# EasyEDA Pro project 电池盒升压.eprj

# Schematic Schematic1
Board Name: Board1; Create Date: 2025-10-24; Page Name: P1; Project Name: 电池盒升压; Schematic Name: Schematic1; Update Date: 2025-11-20; Company: 嘉立创EDA; Page Size: A4; Version: V1.0
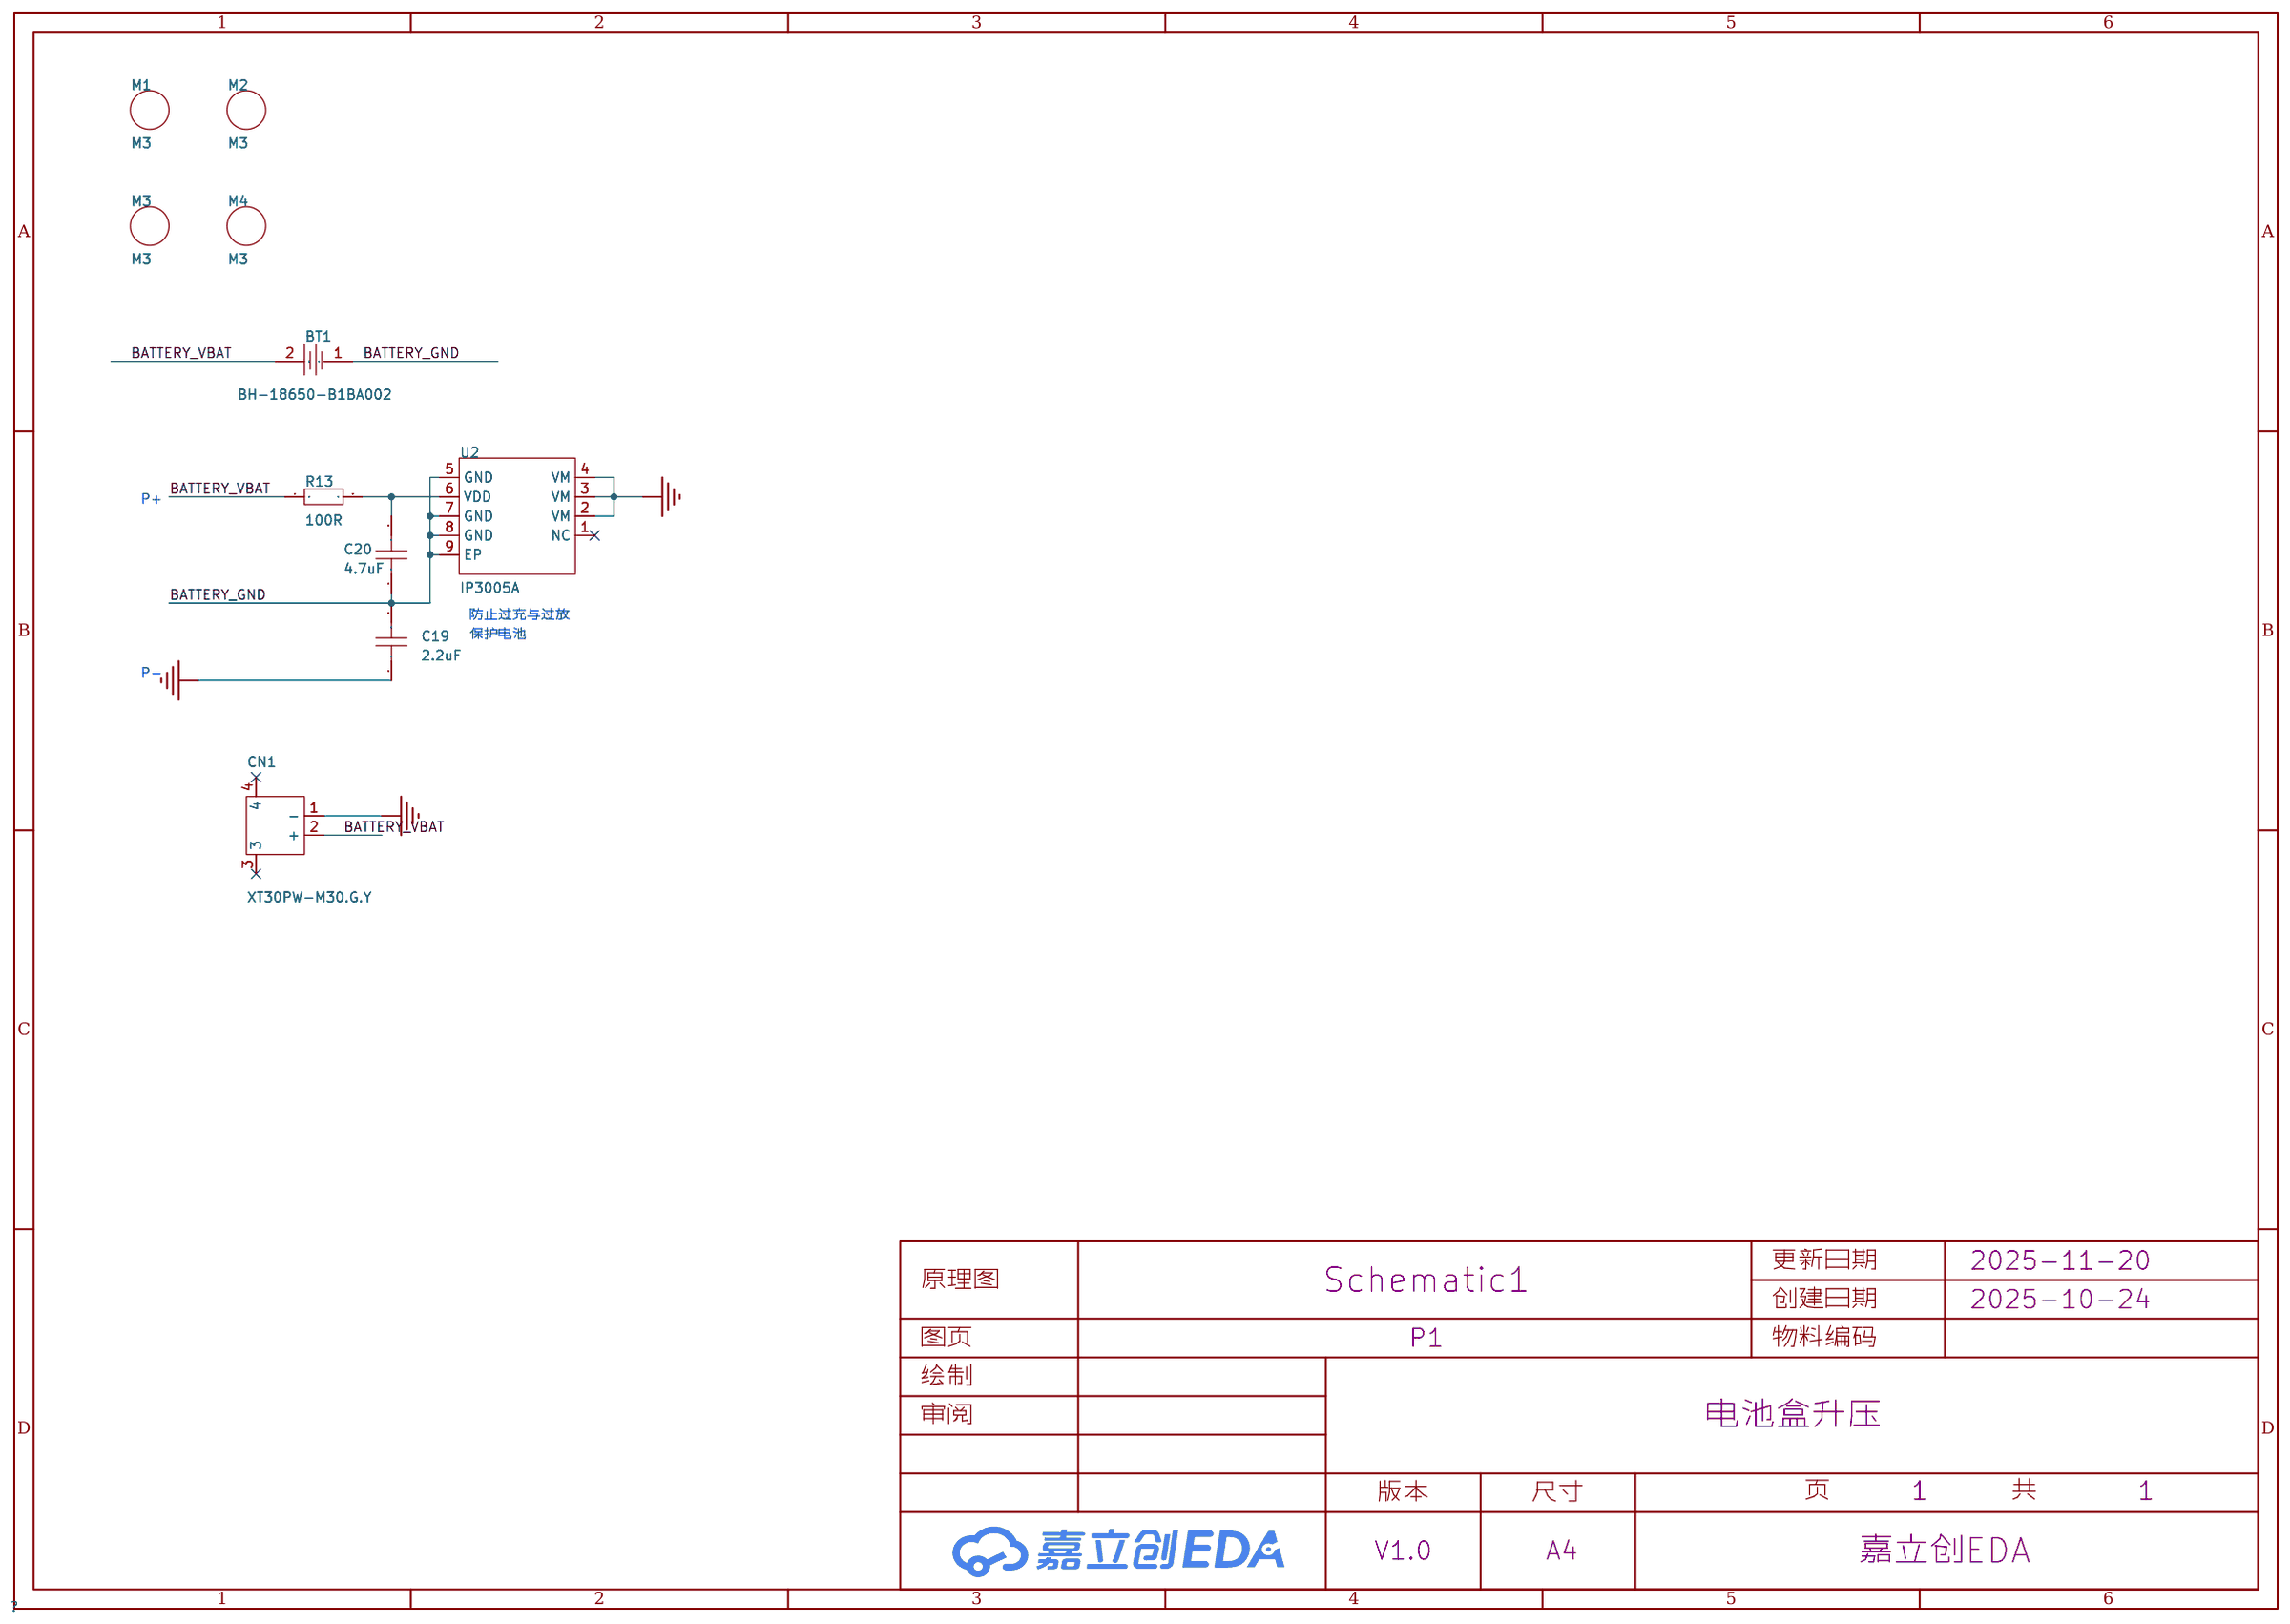
[diagram p0: schematic sheet]

## Parts
BT1  BH-18650-B1BA002  [BATTERY-SMD_18650-1S-L77.1-W20.7-1]
C19  2.2uF  [C0603]
C20  4.7uF  [C0603]
CN1  XT30PW-M30.G.Y  [CONN-TH_XT30PW-M]
M1  M3  [m3螺丝孔]
M2  M3  [m3螺丝孔]
M3  M3  [m3螺丝孔]
M4  M3  [m3螺丝孔]
R13  100R  [R0603]
U2  IP3005A  [ESOP-8_L4.9-W3.9-P1.27-LS6.0-BL-EP]

## Library data of the parts
BT1 = BH-18650-B1BA002: LCSC Part Name: 电池盒 适用电池:18650; Supplier Part: C2988620; Manufacturer: MYOUNG(美阳); Supplier Footprint: SMD; JLCPCB Part Class: 扩展库; Datasheet: https://item.szlcsc.com/datasheet/BH-18650-B1BA002/3446919.html; Supplier: LCSC; Connector Type: 电池盒; Battery Type: 18650
C19 = 0603X225M100NT: 容值:2.2uF;精度:±20%;额定电压:10V;温度系数:X5R;; LCSC Part Name: 2.2uF ±20% 10V; Supplier Part: C2857986; Manufacturer: FH(风华); Supplier Footprint: 0603; JLCPCB Part Class: 扩展库; Datasheet: https://atta.szlcsc.com/upload/public/pdf/source/20241106/0372DBB53BE7B2875A5094F78173A7D7.pdf; Supplier: LCSC; Tolerance: ±20%; Voltage Rating: 10V; Temperature Coefficient: X5R
C20 = GRT188C81E475KE13D: 容值:4.7uF;精度:±10%;额定电压:25V;温度系数:X6S;; LCSC Part Name: 4.7uF ±10% 25V; Supplier Part: C907917; Manufacturer: muRata(村田); Supplier Footprint: 0603; JLCPCB Part Class: 扩展库; Datasheet: https://atta.szlcsc.com/upload/public/pdf/source/20201022/C907724_54A5B6BD9983EF10856A9875562800AA.pdf; Supplier: LCSC; Tolerance: ±10%; Voltage Rating: 25V; Temperature Coefficient: X6S
CN1 = XT30PW-M30.G.Y: LCSC Part Name: AMASS(艾迈斯)航模插头 卧式弯脚 XT30PW-M公头; Supplier Part: C431092; Manufacturer: AMASS(艾迈斯); JLCPCB Part Class: 扩展库; Datasheet: https://item.szlcsc.com/datasheet/XT30PW-M30.G.Y/426930.html; Supplier: LCSC; Type: 航模插头; RatedVoltage: DC 500V; InterfaceType: 公头; RatedCurrent: 15A; RecommendedWireGauge: 16/18/20AWG; contact resistance: 1.2mΩ; specifications: 2pin
M1-M4 = M3: 铜柱孔; BOM名称: 铜柱孔; 学习资源: www.ooocke.com; 版权归属: 源创客; Origin Footprint 2: M3 140X350; Origin Footprint 3: M3 125X300; Origin Footprint 1: M3 125X200; Library Name: Schlib1
R13 = Res_0603: Supplier Footprint: 0603
U2 = IP3005A: 过充电压:4.28V,过充恢复电压:4.1V,高精度内置MOSFET单节锂电池保护IC; Supplier Part: C181685; Manufacturer: INJOINIC(英集芯); Supplier Footprint: ESOP-8; JLCPCB Part Class: 扩展库; Datasheet: https://atta.szlcsc.com/upload/public/pdf/source/20181019/C181685_8FCD62B90ABBC24A3EFF28CA6DF89AAB.pdf; Supplier: LCSC

## Nets
GND: C19.1 CN1.1(-) U2.2(VM) U2.3(VM) U2.4(VM)
BATTERY_GND: BT1.1 C19.2 C20.1 U2.5(GND) U2.7(GND) U2.8(GND) U2.9(EP)
BATTERY_VBAT: BT1.2 CN1.2(+) R13.1
$1N2979: C20.2 R13.2 U2.6(VDD)

Not connected (* = marked no-connect by the designer): CN1 3* 4*; U2 1(NC)*

## Notes on the sheet
- P+
- 防止过充与过放
- 保护电池
- P-

# Board PCB1
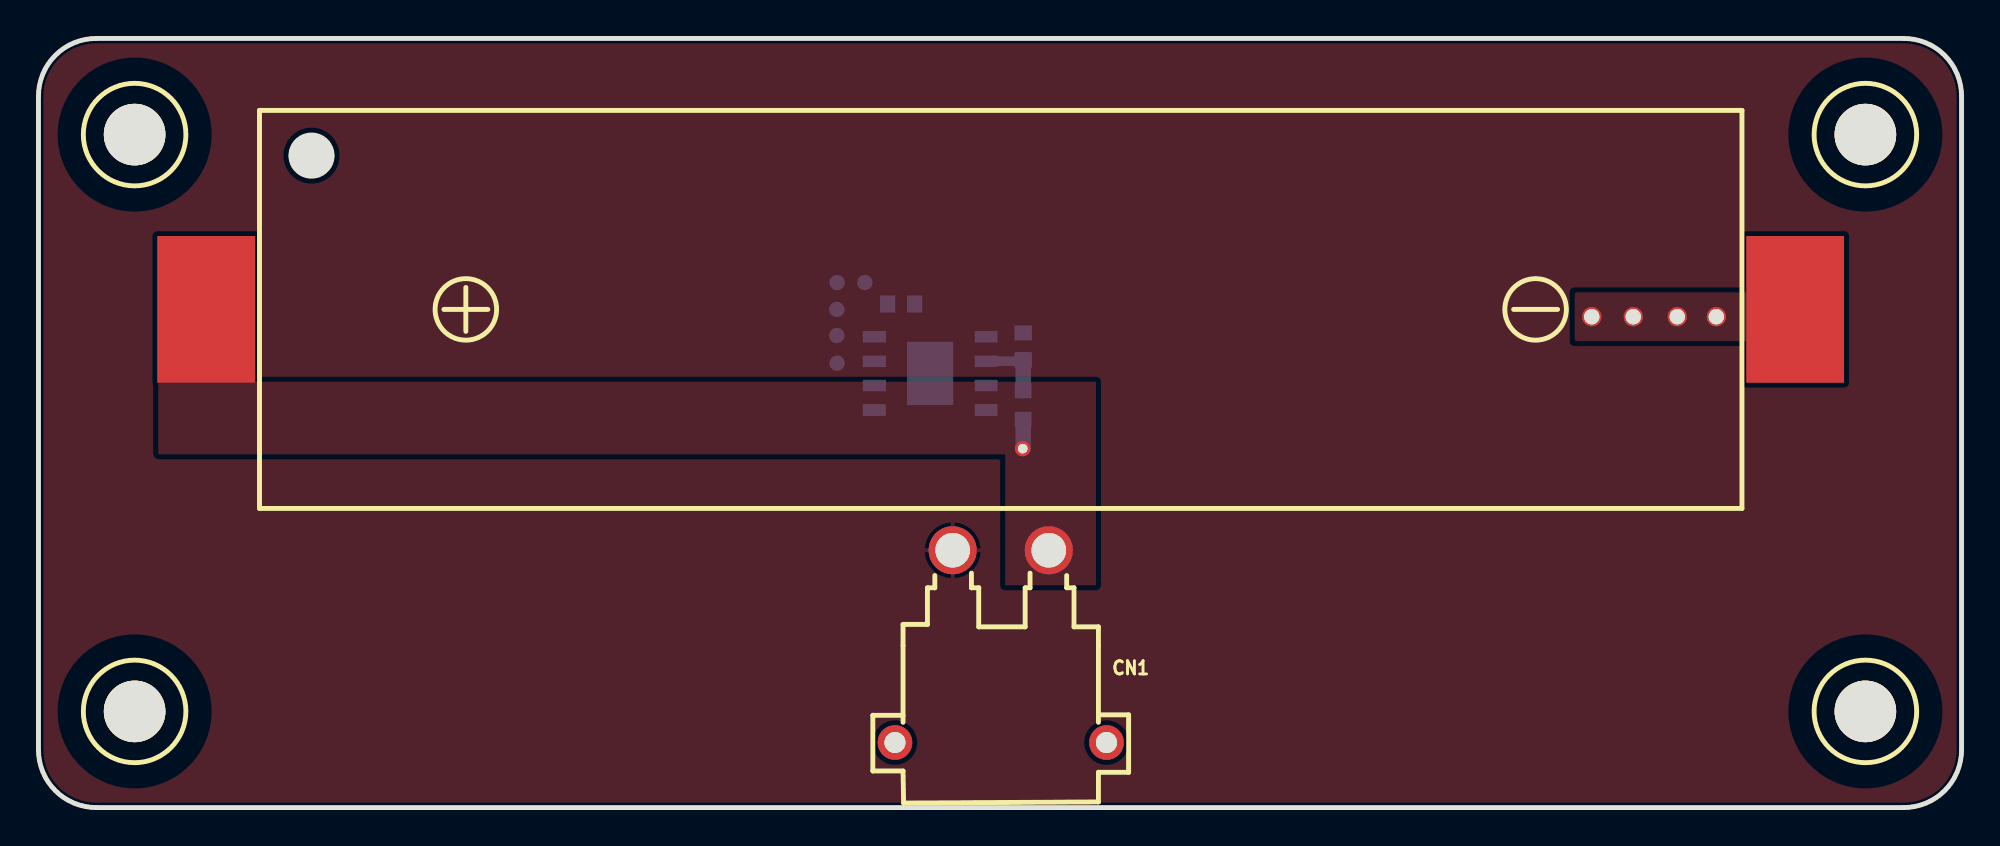
[diagram p1: board, top side]
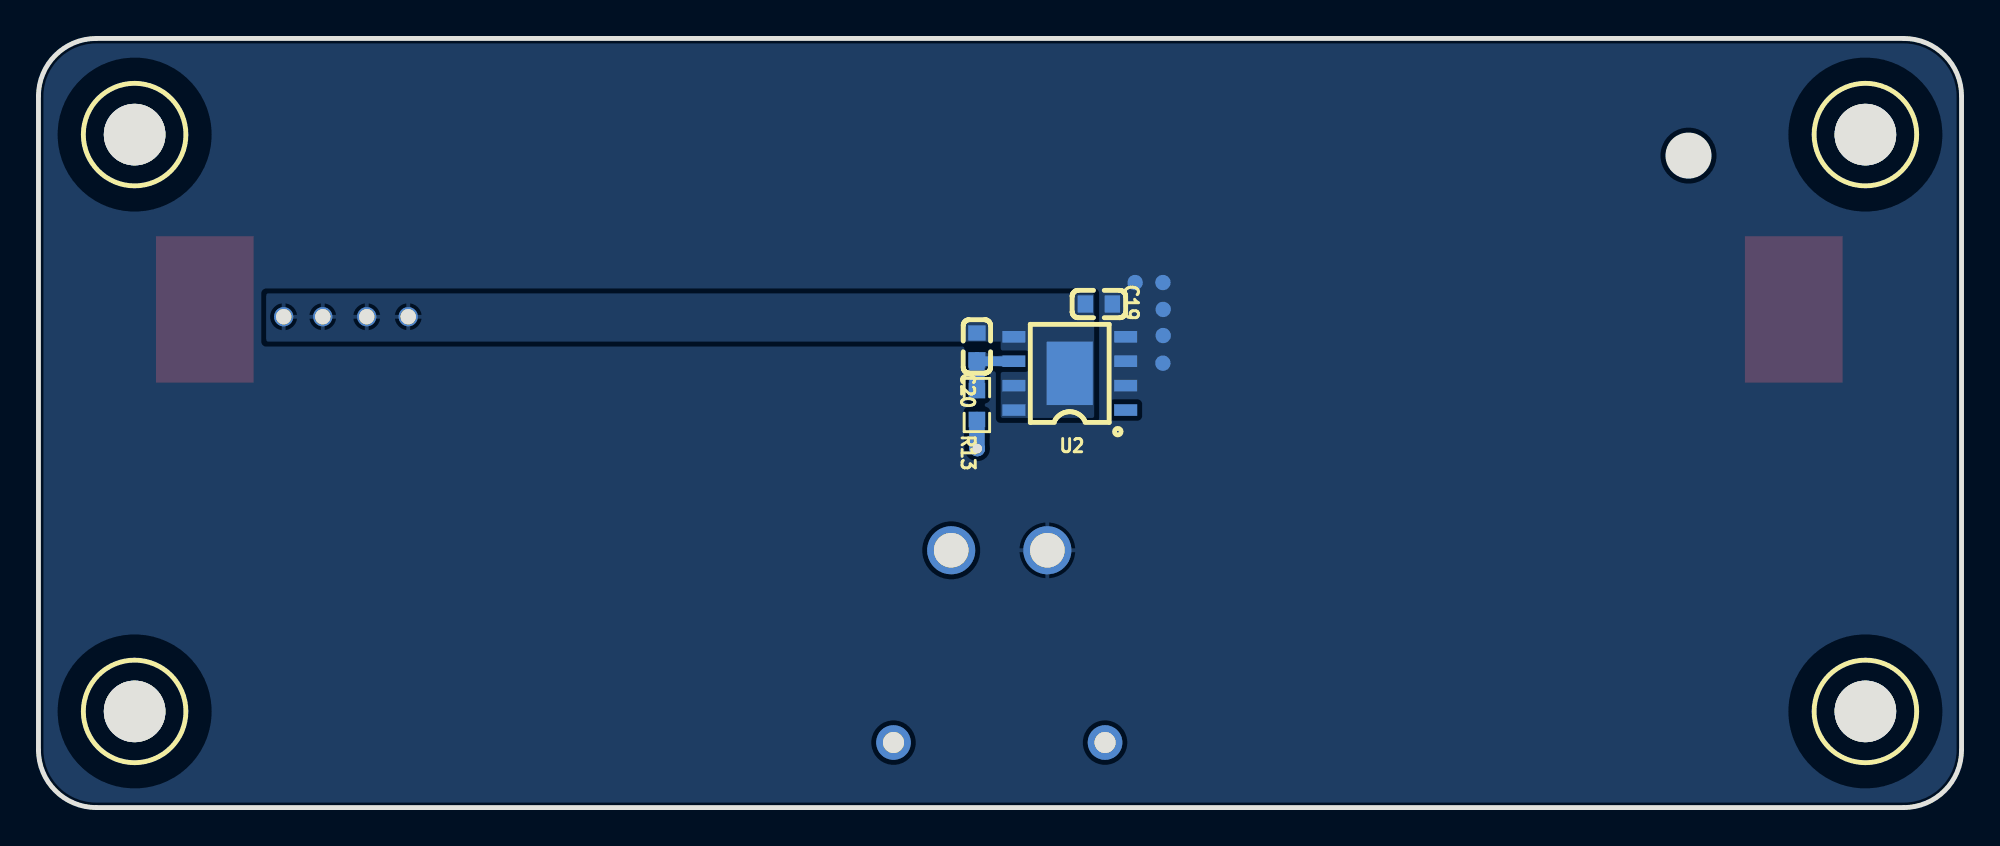
[diagram p2: board, bottom side, seen from below]

Outline 100 x 40 mm; copper layers: Top Layer, Bottom Layer. Coordinates in mm from the lower left corner of the outline.
Outline path: 0,37 0,3 arc(0.88,0.88) 3,0 97,0 arc(99.12,0.88) 100,3 100,37 arc(99.12,39.12) 97,40 3,40 arc(0.88,39.12) 0,37
Stack: Top Layer 0.035mm / Dielectric1 1.51mm FR4 er 4.5 / Bottom Layer 0.035mm

## Design rules (mm)
template: 自定义配置
spacing copperThickness1oz (default): track to track 0.102, other pairs 0.152 to 0.3
spacing copperThickness2oz: track to track 0.203, other pairs 0.152 to 0.3
track width copperThickness1oz (default): min 0.127, default 0.254, max 2.54
track width copperThickness2oz: min 0.203, default 0.254, max 2.54
differential pair differentialPair (default): width min 0.127, default 0.254, max 2.54; gap min 0.152, default 0.152
via viaSize (default): diameter min 0.5, default 0.61, max 10; hole min 0.3, default 0.305, max 6.3
net BATTERY_GND uses copperRegion1
pour e11 uses copperRegion

## Placement (name value [footprint] x y rotation side)
BT1  BH-18650-B1BA002  [BATTERY-SMD_18650-1S-L77.1-W20.7-1]  50.04 25.91 90 top
C19  2.2uF  [C0603]  44.86 26.19 0 bottom
C20  4.7uF  [C0603]  51.2 23.98 270 bottom
CN1  XT30PW-M30.G.Y  [CONN-TH_XT30PW-M]  50.04 8.38 0 top
M1  M3  [m3螺丝孔]  5 5 0 top
M2  M3  [m3螺丝孔]  95 5 0 top
M3  M3  [m3螺丝孔]  5 35 0 top
M4  M3  [m3螺丝孔]  95 35 0 top
NOREF  -  [Pad_e156]  41.53 27.31 0 top
NOREF#2  -  [Pad_e76]  51.18 18.67 0 top
NOREF#3  -  [Pad_e154]  41.51 24.55 0 top
NOREF#4  -  [Pad_e37]  85.22 25.53 0 top
NOREF#5  -  [Pad_e155]  41.53 23.11 0 top
NOREF#6  -  [Pad_e44]  80.77 25.53 0 top
NOREF#7  -  [Pad_e96]  87.25 25.53 0 top
NOREF#8  -  [Pad_e153]  41.51 25.91 0 top
NOREF#9  -  [Pad_e157]  42.97 27.31 0 top
NOREF#10  -  [Pad_e43]  82.93 25.53 0 top
R13  100R  [R0603]  51.2 20.93 90 bottom
U2  IP3005A  [ESOP-8_L4.9-W3.9-P1.27-LS6.0-BL-EP]  46.37 22.58 90 bottom

## Footprints (pads in the part's own frame, mm; a bottom-side part is the same pattern mirrored in y, then rotated)
BATTERY-SMD_18650-1S-L77.1-W20.7-1
  rect 7.62x5.08 smd: 1(0,-41.313) 2(0,41.313)
C0603
  rect 0.8x0.9 smd: 1(-0.7,0) 2(0.7,0)
CONN-TH_XT30PW-M
  round 2.5 hole 1.8: 1(-2.5,5) 2(2.5,5)
  round 1.8 hole 1.1: 3(5.5,-5) 4(-5.5,-5)
ESOP-8_L4.9-W3.9-P1.27-LS6.0-BL-EP
  rect 0.6x1.2 smd: 1(-1.905,-2.909) 2(-0.635,-2.909) 3(0.635,-2.909) 4(1.905,-2.909) 5(1.905,2.909) 6(0.635,2.909) 7(-0.635,2.909) 8(-1.905,2.909)
  rect 3.3x2.4 smd: 9(0,0)
m3螺丝孔
  round 3.2 hole 3.2: 1(0,0)
Pad_e37
  round 1 hole 0.8: 1(0,0)
Pad_e43
  round 1 hole 0.8: 1(0,0)
Pad_e44
  round 1 hole 0.8: 1(0,0)
Pad_e76
  round 0.8 hole 0.5: 1(0,0)
Pad_e96
  round 1 hole 0.8: 1(0,0)
Pad_e153
  round 0.8 smd far side: 1(0,0)
Pad_e154
  round 0.8 smd far side: 2(0,0)
Pad_e155
  round 0.8 smd far side: 3(0,0)
Pad_e156
  round 0.8 smd far side: 4(0,0)
Pad_e157
  round 0.8 smd far side: 5(0,0)
R0603
  rect 0.806x0.864 smd: 1(-0.753,0) 2(0.753,0)

## Nets
GND: C19.1 CN1.1 NOREF.4 NOREF#3.2 NOREF#5.3 NOREF#8.1 NOREF#9.5 U2.2 U2.3 U2.4
BATTERY_GND: BT1.1 C19.2 C20.1 NOREF#4.1 NOREF#6.1 NOREF#7.1 NOREF#10.1 U2.5 U2.7 U2.8 U2.9
BATTERY_VBAT: BT1.2 CN1.2 NOREF#2.1 R13.1
$1N2979: C20.2 R13.2 U2.6

Pads without a net: CN1 3 4; M1 1; M2 1; M3 1; M4 1; U2 1

## Routing (per net, layer and track width the routed paths; a pad name or vN(x,y) marks a point on that pad's centre or on a via; arc(x,y) is an arc through that point)
BATTERY_VBAT: length 1.5
  Bottom Layer w0.8: NOREF#2.1 51.2,18.69 51.2,20.18
$1N2979: length 3.5
  Bottom Layer w0.5: U2.6 51.13,23.21 C20.2
  Bottom Layer w0.8: C20.2 R13.2

## Copper pours and planes (outline as drawn; the poured copper is in the pictures)
GND on Top Layer: 0.06,40 100.01,40 100.01,-0.01 0.06,-0.01
GND on Bottom Layer: 0.06,39.97 100.01,39.97 100.01,-0.03 0.06,-0.03
BATTERY_GND on Top Layer: 79.88,26.8 88.9,26.8 88.9,24.26 79.88,24.26
BATTERY_GND on Bottom Layer: 45.11,20.26 45.11,26.74 88.16,26.74 88.16,24.23 49.96,24.23 49.96,20.26
BATTERY_VBAT on Top Layer: 6.22,22.15 54.99,22.15 54.99,11.56 6.22,11.56

Small or netless copper shapes (teardrops, artwork), in the pictures only: 6 on Bottom Layer
